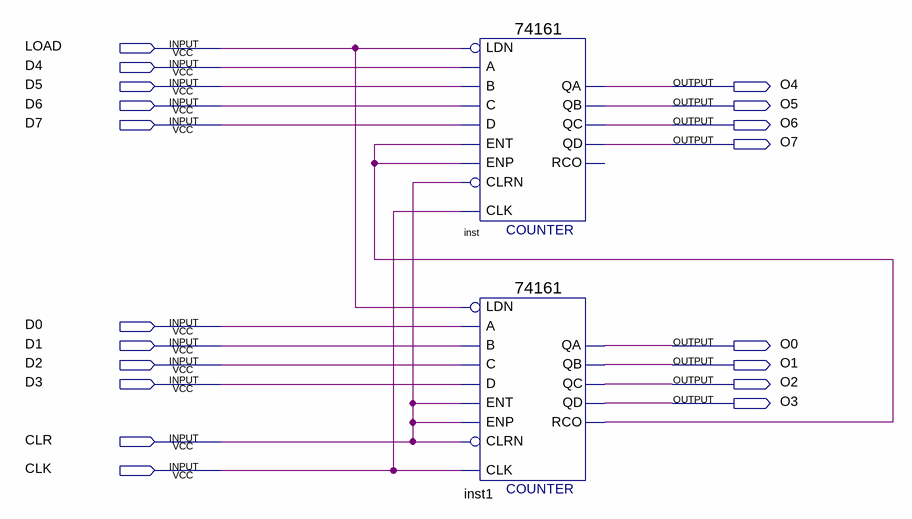
[diagram p0: schematic sheet]
// Quartus schematic COUNTER8.bdf as structural Verilog: 2 symbols, 19 pins
module COUNTER8 (
  input  LOAD,
  input  D4,
  input  D5,
  input  D6,
  input  D7,
  input  D0,
  input  D1,
  input  D2,
  input  D3,
  input  CLR,
  input  CLK,
  output O4,
  output O5,
  output O6,
  output O7,
  output O0,
  output O1,
  output O2,
  output O3
);

  wire inst1_rco;

  \74161  inst (
    .CLRN(CLR), .CLK(CLK), .ENP(inst1_rco), .LDN(LOAD), .A(D4), .D(D7), .ENT(inst1_rco), .B(D5), .C(D6),
    .QD(O7), .QC(O6), .QB(O5), .QA(O4));  // open: RCO
  \74161  inst1 (
    .CLRN(CLR), .CLK(CLK), .ENP(CLR), .LDN(LOAD), .A(D0), .D(D3), .ENT(CLR), .B(D1), .C(D2), .QD(O3),
    .QC(O2), .QB(O1), .QA(O0), .RCO(inst1_rco));
endmodule
